# Altium schematic sheet CLK_HMC7044.SchDoc
size A3; DocumentNumber: 1; SheetNumber: 1; SheetTotal: 5
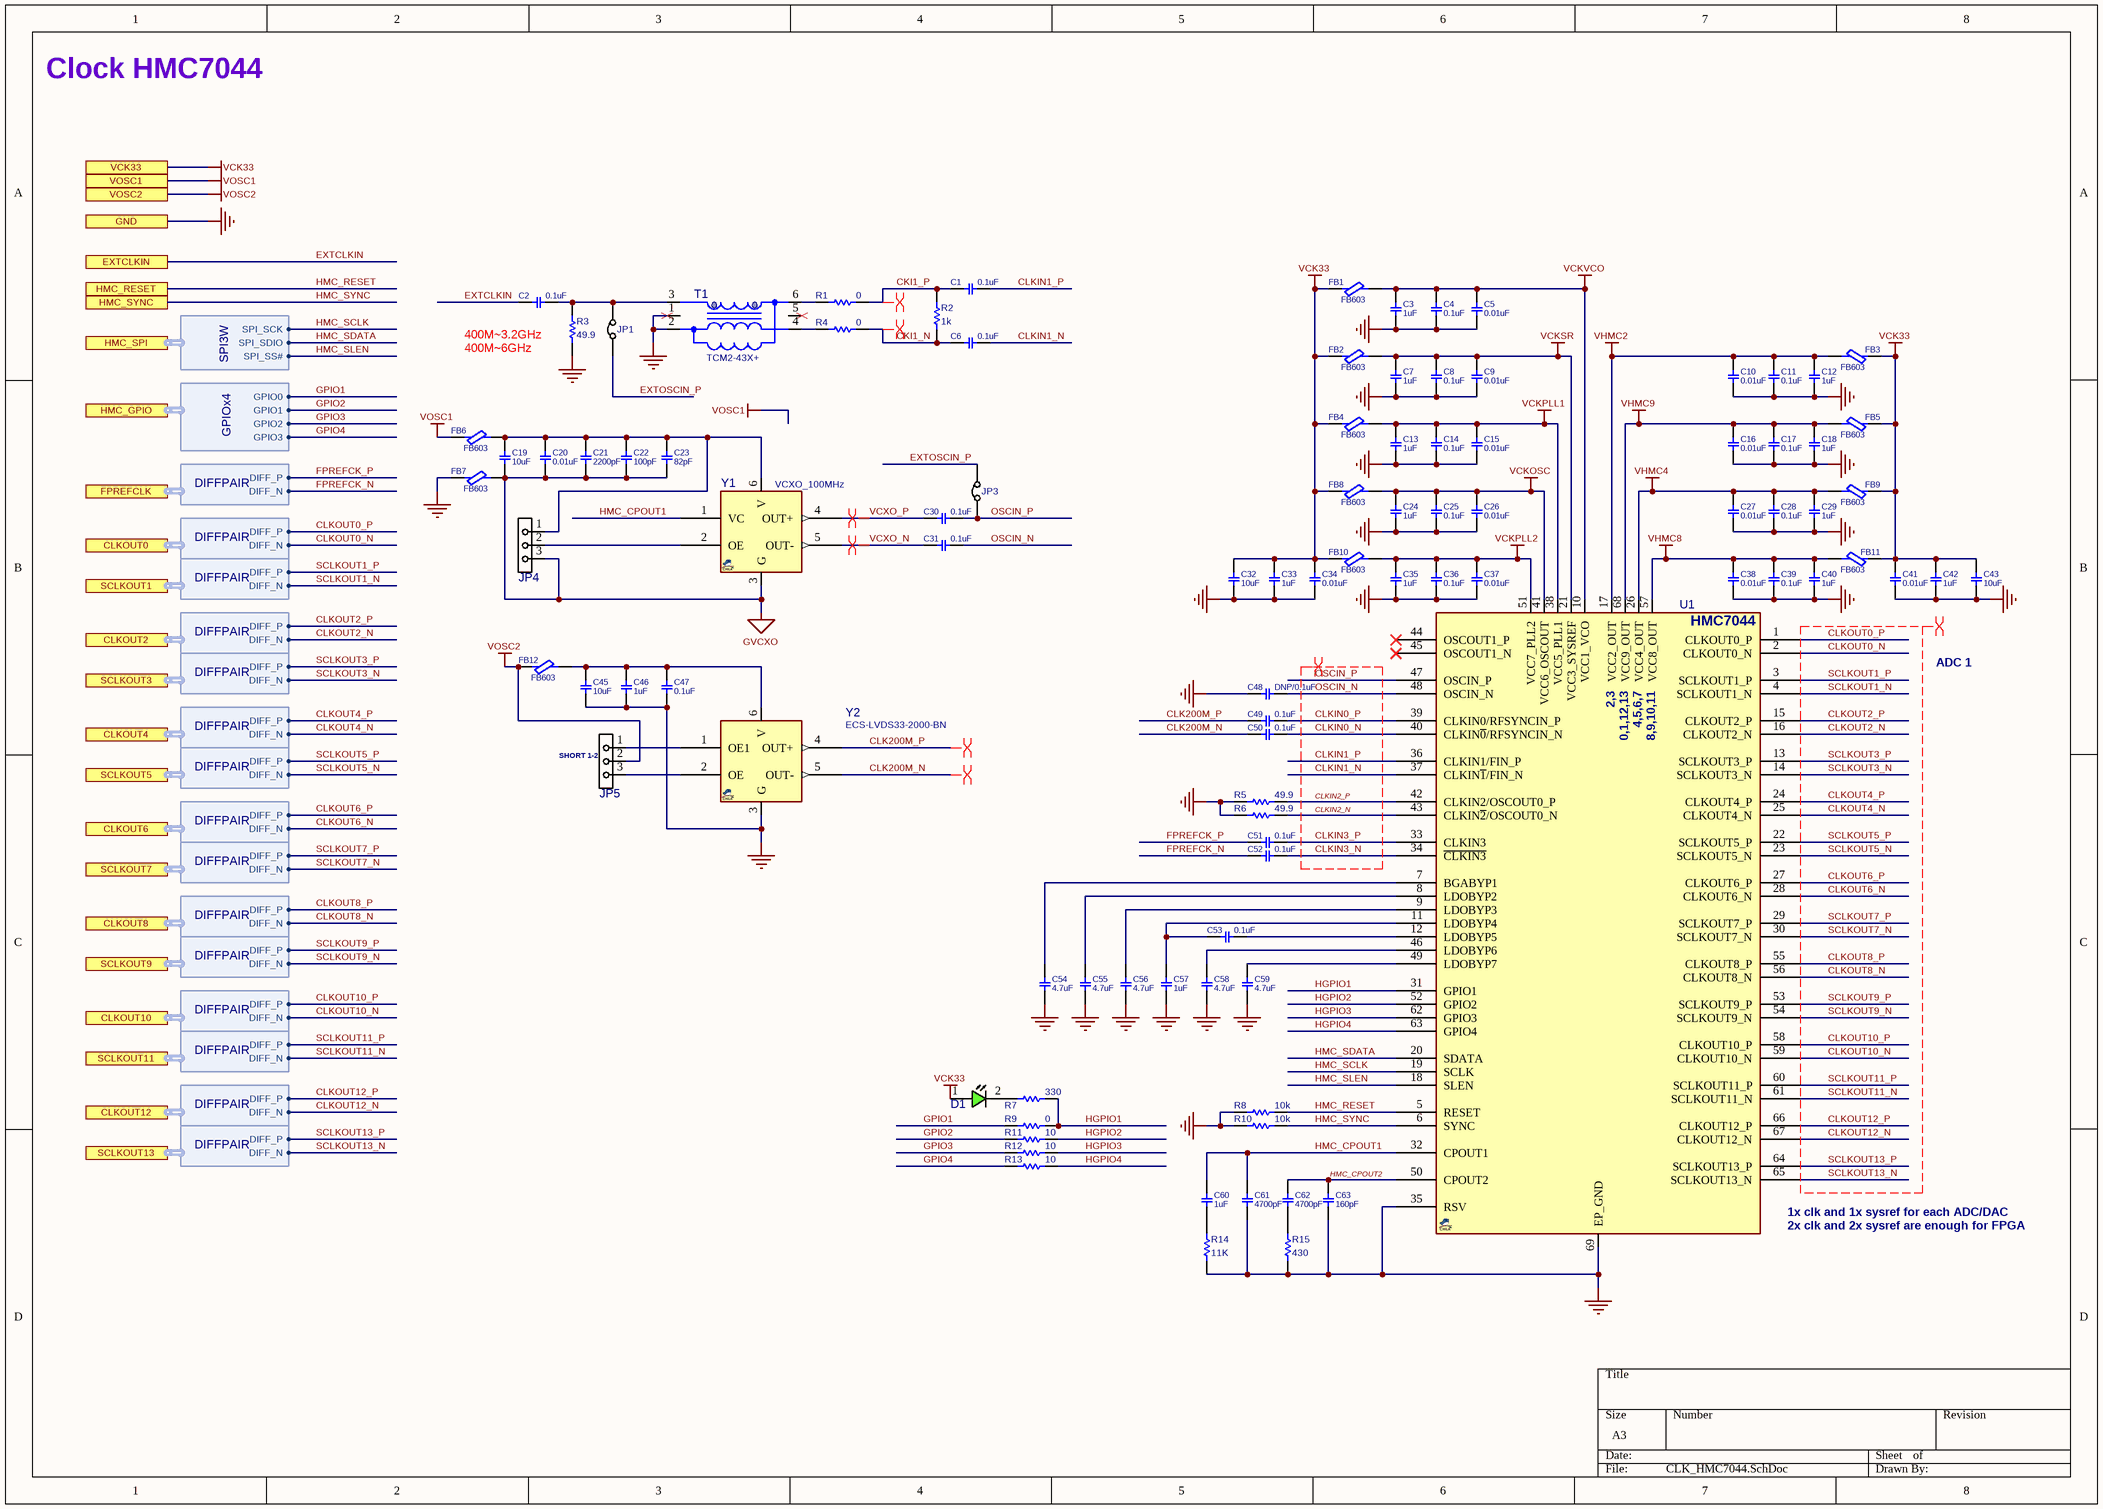
[diagram p0: CLK_HMC7044.SchDoc]

## Parts
C1  0.1uF  [C0402]
C2  0.1uF  [C0402]
C3  1uF  [C0402]
C4  0.1uF  [C0402]
C5  0.01uF  [C0402]
C6  0.1uF  [C0402]
C7  1uF  [C0402]
C8  0.1uF  [C0402]
C9  0.01uF  [C0402]
C10  0.01uF  [C0402]
C11  0.1uF  [C0402]
C12  1uF  [C0402]
C13  1uF  [C0402]
C14  0.1uF  [C0402]
C15  0.01uF  [C0402]
C16  0.01uF  [C0402]
C17  0.1uF  [C0402]
C18  1uF  [C0402]
C19  10uF  [C0402]
C20  0.01uF  [C0402]
C21  2200pF  [C0402]
C22  100pF  [C0402]
C23  82pF  [C0402]
C24  1uF  [C0402]
C25  0.1uF  [C0402]
C26  0.01uF  [C0402]
C27  0.01uF  [C0402]
C28  0.1uF  [C0402]
C29  1uF  [C0402]
C30  0.1uF  [C0402]
C31  0.1uF  [C0402]
C32  10uF  [C0402]
C33  1uF  [C0402]
C34  0.01uF  [C0402]
C35  1uF  [C0402]
C36  0.1uF  [C0402]
C37  0.01uF  [C0402]
C38  0.01uF  [C0402]
C39  0.1uF  [C0402]
C40  1uF  [C0402]
C41  0.01uF  [C0402]
C42  1uF  [C0402]
C43  10uF  [C0402]
C45  10uF  [C0402]
C46  1uF  [C0402]
C47  0.1uF  [C0402]
C48  DNP/0.1uF  [C0402]
C49  0.1uF  [C0402]
C50  0.1uF  [C0402]
C51  0.1uF  [C0402]
C52  0.1uF  [C0402]
C53  0.1uF  [C0402]
C54  4.7uF  [C0402]
C55  4.7uF  [C0402]
C56  4.7uF  [C0402]
C57  1uF  [C0402]
C58  4.7uF  [C0402]
C59  4.7uF  [C0402]
C60  1uF  [C0402]
C61  4700pF  [C0402]
C62  4700pF  [C0402]
C63  160pF  [C0402]
D1  LED603GRN  [LED0603GRN]  (value not drawn)
FB1  FB603  [L0603]
FB2  FB603  [L0603]
FB3  FB603  [L0603]
FB4  FB603  [L0603]
FB5  FB603  [L0603]
FB6  FB603  [L0603]
FB7  FB603  [L0603]
FB8  FB603  [L0603]
FB9  FB603  [L0603]
FB10  FB603  [L0603]
FB11  FB603  [L0603]
FB12  FB603  [L0603]
JP1  JMPSOLDER  [JP_40X50]  (value not drawn)  (no BOM)
JP3  JMPSOLDER  [JP_40X50]  (value not drawn)  (no BOM)
JP4  JMPHDR3PIN  [JP_3_40X90]  (value not drawn)  (no BOM)
JP5  JMPHDR3PIN  [JP_3_40X90]  (value not drawn)  (no BOM)
R1  0  [R0402]
R2  1k  [R0402]
R3  49.9  [R0402]
R4  0  [R0402]
R5  49.9  [R0402]
R6  49.9  [R0402]
R7  330  [R0402]
R8  10k  [R0402]
R9  0  [R0402]
R10  10k  [R0402]
R11  10  [R0402]
R12  10  [R0402]
R13  10  [R0402]
R14  11K  [R0402]
R15  430  [R0402]
T1  TCM2-43X+  [TRNS127_6_S380CW]
U1  HMC7044  [QFN50_68T]  (value not drawn)
Y1  VCXO_100MHz  [XTL_6_9X14]
Y2  ECS-LVDS33-2000-BN  [XTL_6_7050]

## Ports
CLKOUT0 (harness DIFFPAIR), CLKOUT2 (harness DIFFPAIR), CLKOUT4 (harness DIFFPAIR), CLKOUT6 (harness DIFFPAIR), CLKOUT8 (harness DIFFPAIR), CLKOUT10 (harness DIFFPAIR), CLKOUT12 (harness DIFFPAIR), EXTCLKIN, FPREFCLK (harness DIFFPAIR), GND, HMC_GPIO (harness GPIOx4), HMC_RESET, HMC_SPI (harness SPI3W), HMC_SYNC, SCLKOUT1 (harness DIFFPAIR), SCLKOUT3 (harness DIFFPAIR), SCLKOUT5 (harness DIFFPAIR), SCLKOUT7 (harness DIFFPAIR), SCLKOUT9 (harness DIFFPAIR), SCLKOUT11 (harness DIFFPAIR), SCLKOUT13 (harness DIFFPAIR), VCK33, VOSC1, VOSC2

## Harnesses
SPI3W: SPI_SCK, SPI_SDIO, SPI_SS#
GPIOx4: GPIO0, GPIO1, GPIO2, GPIO3
DIFFPAIR: DIFF_N, DIFF_P

## Nets
GND: C3.2 C4.2 C5.2 C7.2 C8.2 C9.2 C10.2 C11.2 C12.2 C13.2 C14.2 C15.2 C16.2 C17.2 C18.2 C24.2 C25.2 C26.2 C27.2 C28.2 C29.2 C32.2 C33.2 C34.2 C35.2 C36.2 C37.2 C38.2 C39.2 C40.2 C41.2 C42.2 C43.2 C45.2 C46.2 C47.1 C48.1 C54.2 C55.2 C56.2 C57.2 C58.2 C59.2 C61.1 C63.1 FB7.1 R3.1 R5.2 R6.2 R8.1 R10.1 R14.1 R15.1 T1.1(NC) T1.2(PRI) U1.35(RSV) U1.69(EP_GND) Y2.3(G) ; port GND
GVCXO: C19.2 C20.1 C21.1 C22.1 C23.1 FB7.2 JP4.3 Y1.3(G)
VCK33: C32.1 C33.1 C34.1 C41.1 C42.1 C43.1 D1.1(ANODE) FB1.1 FB2.1 FB3.1 FB4.1 FB5.1 FB8.1 FB9.1 FB10.1 FB11.1 ; port VCK33
VCKOSC: C24.1 C25.1 C26.1 FB8.2 U1.41(VCC6_OSCOUT)
VCKPLL1: C13.1 C14.1 C15.1 FB4.2 U1.38(VCC5_PLL1)
VCKPLL2: C35.1 C36.1 C37.1 FB10.2 U1.51(VCC7_PLL2)
VCKSR: C7.1 C8.1 C9.1 FB2.2 U1.21(VCC3_SYSREF)
VCKVCO: C3.1 C4.1 C5.1 FB1.2 U1.10(VCC1_VCO)
VHMC2: C10.1 C11.1 C12.1 FB3.2 U1.17(VCC2_OUT)
VHMC4: C27.1 C28.1 C29.1 FB9.2 U1.26(VCC4_OUT)
VHMC8: C38.1 C39.1 C40.1 FB11.2 U1.57(VCC8_OUT)
VHMC9: C16.1 C17.1 C18.1 FB5.2 U1.68(VCC9_OUT)
VOSC1: FB6.1 ; port VOSC1
VOSC2: FB12.1 JP5.2 ; port VOSC2
CKI1_N: C6.1 R2.1 R4.1
CKI1_P: C1.1 R1.1 R2.2
CLK200M_N: C50.1 Y2.5(OUT-)
CLK200M_P: C49.1 Y2.4(OUT+)
CLKIN0_N: C50.2 U1.40(CLKIN~{0}/RFSYNCIN_N)
CLKIN0_P: C49.2 U1.39(CLKIN0/RFSYNCIN_P)
CLKIN1_N: C6.2 U1.37(CLKIN~{1}/FIN_N)
CLKIN1_P: C1.2 U1.36(CLKIN1/FIN_P)
CLKIN2_N: R6.1 U1.43(CLKIN~{2}/OSCOUT0_N)
CLKIN2_P: R5.1 U1.42(CLKIN2/OSCOUT0_P)
CLKIN3_N: C52.2 U1.34(~{CLKIN3})
CLKIN3_P: C51.2 U1.33(CLKIN3)
CLKOUT0_N: U1.2(CLKOUT0_N) ; port CLKOUT0.DIFF_N
CLKOUT0_P: U1.1(CLKOUT0_P) ; port CLKOUT0.DIFF_P
CLKOUT2_N: U1.16(CLKOUT2_N) ; port CLKOUT2.DIFF_N
CLKOUT2_P: U1.15(CLKOUT2_P) ; port CLKOUT2.DIFF_P
CLKOUT4_N: U1.25(CLKOUT4_N) ; port CLKOUT4.DIFF_N
CLKOUT4_P: U1.24(CLKOUT4_P) ; port CLKOUT4.DIFF_P
CLKOUT6_N: U1.28(CLKOUT6_N) ; port CLKOUT6.DIFF_N
CLKOUT6_P: U1.27(CLKOUT6_P) ; port CLKOUT6.DIFF_P
CLKOUT8_N: U1.56(CLKOUT8_N) ; port CLKOUT8.DIFF_N
CLKOUT8_P: U1.55(CLKOUT8_P) ; port CLKOUT8.DIFF_P
CLKOUT10_N: U1.59(CLKOUT10_N) ; port CLKOUT10.DIFF_N
CLKOUT10_P: U1.58(CLKOUT10_P) ; port CLKOUT10.DIFF_P
CLKOUT12_N: U1.67(CLKOUT12_N) ; port CLKOUT12.DIFF_N
CLKOUT12_P: U1.66(CLKOUT12_P) ; port CLKOUT12.DIFF_P
EXTCLKIN: C2.1 ; port EXTCLKIN
EXTOSCIN_P: JP1.1 JP3.2
FPREFCK_N: C52.1 ; port FPREFCLK.DIFF_N
FPREFCK_P: C51.1 ; port FPREFCLK.DIFF_P
GPIO1: R9.2 ; port HMC_GPIO.GPIO0
GPIO2: R11.2 ; port HMC_GPIO.GPIO1
GPIO3: R12.2 ; port HMC_GPIO.GPIO2
GPIO4: R13.2 ; port HMC_GPIO.GPIO3
HGPIO1: R7.2 R9.1 U1.31(GPIO1)
HGPIO2: R11.1 U1.52(GPIO2)
HGPIO3: R12.1 U1.62(GPIO3)
HGPIO4: R13.1 U1.63(GPIO4)
HMC_CPOUT1: C60.1 C61.2 U1.32(CPOUT1) Y1.1(VC)
HMC_CPOUT2: C62.2 C63.2 U1.50(CPOUT2)
HMC_RESET: R8.2 U1.5(RESET) ; port HMC_RESET
HMC_SCLK: U1.19(SCLK) ; port HMC_SPI.SPI_SCK
HMC_SDATA: U1.20(SDATA) ; port HMC_SPI.SPI_SDIO
HMC_SLEN: U1.18(SLEN) ; port HMC_SPI.SPI_SS#
HMC_SYNC: R10.2 U1.6(SYNC) ; port HMC_SYNC
OSCIN_N: C31.2 C48.2 U1.48(OSCIN_N)
OSCIN_P: C30.2 JP3.1 U1.47(OSCIN_P)
SCLKOUT1_N: U1.4(SCLKOUT1_N) ; port SCLKOUT1.DIFF_N
SCLKOUT1_P: U1.3(SCLKOUT1_P) ; port SCLKOUT1.DIFF_P
SCLKOUT3_N: U1.14(SCLKOUT3_N) ; port SCLKOUT3.DIFF_N
SCLKOUT3_P: U1.13(SCLKOUT3_P) ; port SCLKOUT3.DIFF_P
SCLKOUT5_N: U1.23(SCLKOUT5_N) ; port SCLKOUT5.DIFF_N
SCLKOUT5_P: U1.22(SCLKOUT5_P) ; port SCLKOUT5.DIFF_P
SCLKOUT7_N: U1.30(SCLKOUT7_N) ; port SCLKOUT7.DIFF_N
SCLKOUT7_P: U1.29(SCLKOUT7_P) ; port SCLKOUT7.DIFF_P
SCLKOUT9_N: U1.54(SCLKOUT9_N) ; port SCLKOUT9.DIFF_N
SCLKOUT9_P: U1.53(SCLKOUT9_P) ; port SCLKOUT9.DIFF_P
SCLKOUT11_N: U1.61(SCLKOUT11_N) ; port SCLKOUT11.DIFF_N
SCLKOUT11_P: U1.60(SCLKOUT11_P) ; port SCLKOUT11.DIFF_P
SCLKOUT13_N: U1.65(SCLKOUT13_N) ; port SCLKOUT13.DIFF_N
SCLKOUT13_P: U1.64(SCLKOUT13_P) ; port SCLKOUT13.DIFF_P
VCXO_N: C31.1 Y1.5(OUT-)
VCXO_P: C30.1 Y1.4(OUT+)
NetC2_2: C2.2 JP1.2 R3.2 T1.3(PRI.)
NetC19_1: C19.1 C20.2 C21.2 C22.2 C23.2 FB6.2 JP4.1 Y1.6(V)
NetC45_1: C45.1 C46.1 C47.2 FB12.2 Y2.6(V)
NetC53_1: C53.1 C57.1 U1.11(LDOBYP4)
NetC53_2: C53.2 U1.12(LDOBYP5)
NetC54_1: C54.1 U1.7(BGABYP1)
NetC55_1: C55.1 U1.8(LDOBYP2)
NetC56_1: C56.1 U1.9(LDOBYP3)
NetC58_1: C58.1 U1.46(LDOBYP6)
NetC59_1: C59.1 U1.49(LDOBYP7)
NetC60_2: C60.2 R14.2
NetC62_1: C62.1 R15.2
NetD1_2: D1.2(CATHODE) R7.1
NetJP4_2: JP4.2 Y1.2(OE)
NetJP5_1: JP5.1 Y2.1(OE1)
NetJP5_3: JP5.3 Y2.2(OE)
NetR1_2: R1.2 T1.6(SEC.)
NetR4_2: R4.2 T1.4(SEC)

Not connected (* = marked no-connect by the designer): T1 5(NC); U1 44(OSCOUT1_P)* 45(OSCOUT1_N)*

## Layout directives
differential pair: CKI1_N, CKI1_P, CLK200M_N, CLK200M_P, CLKIN0_N, CLKIN0_P, CLKIN1_N, CLKIN1_P, CLKIN2_N, CLKIN2_P, CLKIN3_N, CLKIN3_P, CLKOUT0_N, CLKOUT0_P, CLKOUT2_N, CLKOUT2_P, CLKOUT4_N, CLKOUT4_P, CLKOUT6_N, CLKOUT6_P, CLKOUT8_N, CLKOUT8_P, CLKOUT10_N, CLKOUT10_P, CLKOUT12_N, CLKOUT12_P, OSCIN_N, OSCIN_P, SCLKOUT1_N, SCLKOUT1_P, SCLKOUT3_N, SCLKOUT3_P, SCLKOUT5_N, SCLKOUT5_P, SCLKOUT7_N, SCLKOUT7_P, SCLKOUT9_N, SCLKOUT9_P, SCLKOUT11_N, SCLKOUT11_P, SCLKOUT13_N, SCLKOUT13_P, VCXO_N, VCXO_P

## Notes on the sheet
- Clock HMC7044
- 400M~3.2GHz
- 400M~6GHz
- ADC 1
- (near JP5) SHORT 1-2
- (near U1) 2x clk and 2x sysref are enough for FPGA
- (near U1) 1x clk and 1x sysref for each ADC/DAC
- (in symbol HMC7044_QFN68) 2,3; 0,1,12,13; 4,5,6,7; 8,9,10,11

## Library data of the parts
C1 C2 C4-C6 C8-C11 C14-C17 C20 C21 C25-C28 C30 C31 C34 C36-C39 C41 C47-C53 C61 C62 = CAP_SMD_MLCC_100n50T: CAP, MLCC; PARAM: 50V; PARAM2: X5R, 10%; MANF_P#: -; MANF: -; DESC: -; ASSEMBLY: ASSEMBLY
  C1 C2 C4 C6 C8 C11 C14 C17 C25 C28 C30 C31 C36 C39 C47 C49-C53: PRICE: 100= 5$; VALUE: 0.1uF
  C5 C9 C10 C15 C16 C26 C27 C34 C37 C38 C41: PRICE: 100= 5$; VALUE: 0.01uF
  C20: PRICE: -; VALUE: 0.01uF
  C21: PRICE: -; VALUE: 2200pF
  C48: PRICE: 100= 5$; VALUE: DNP/0.1uF
  C61 C62: PRICE: -; VALUE: 4700pF
C3 C7 C12 C13 C18 C19 C24 C29 C32 C33 C35 C40 C42 C43 C45 C46 C54-C60 = CAP_SMD_MLCC_100n50T: CAP, MLCC; PARAM: 10V; PARAM2: X5R, 10%; MANF_P#: -; MANF: -; DESC: -; ASSEMBLY: ASSEMBLY; PRICE: 100= 5$
  C3 C7 C12 C13 C18 C24 C29 C33 C35 C40 C42 C46 C57 C60: VALUE: 1uF
  C19 C32 C43 C45: VALUE: 10uF
  C54-C56 C58 C59: VALUE: 4.7uF
C22 C23 C63 = CAP_SMD_MLCC_100n50T: CAP, MLCC; PARAM: 50V; PARAM2: C0G, 10%; MANF_P#: -; MANF: -; DESC: -; ASSEMBLY: ASSEMBLY; PRICE: -
  C22: VALUE: 100pF
  C23: VALUE: 82pF
  C63: VALUE: 160pF
D1 = LED_SMD_0603_GRN: LED, SMD, 0603, GREEN; PARAM: 20mA; MANF: Kingbright; DESC: DESCRIPTION; MANF_P#: APT1608SGC; PARAM2: 2.2V; ASSEMBLY: ASSEMBLY; PRICE: 1: 0.14$, 100: 6.8$; VALUE: LED603GRN
FB1-FB12 = FBEAD_SMD_BLM18PG121: FERRITE_Bead, 0603, 2A, 50mOhm, 120@100MHz; MANF: MURATA; MANF_P#: BLM18PG121SN1D; PARAM: 120@100MHz; PARAM2: 2A, 50mOhm; VALUE: FB603
JP1 JP3 = JUMPER_SOLDER: JUMPER,  solder; MANF: MANF; MANF_P#: MANF_P#; VALUE: JMPSOLDER
JP4 JP5 = JUMPER_SOLDER_3P: JUMPER, HEADER 3PIN; MANF: MANF; MANF_P#: MANF_P#; VALUE: JMPHDR3PIN
R1-R8 R10 R14 R15 = Res: Resistor
  R1 R4: Value: 0
  R2: Value: 1k
  R3 R5 R6: Value: 49.9
  R7: Value: 330
  R8 R10: Value: 10k
  R14: Value: 11K
  R15: Value: 430
R9 R11-R13 = RES_SMD_0402: RESISTOR, SMD; PARAM: -W; DESC: DESCRIPTION; DIST#: MOUSER; PARAM2: 1%; MANF_P#: -; MANF: -; ASSEMBLY: ASSEMBLY; PRICE: 100= 0.5$
  R9: VALUE: 0
  R11-R13: VALUE: 10
T1 = TCM2-43X+: RF Transformer, 1:2, 50Ohm, 10~4000MHz; MANF: Mini-Circuit; PARAM: 10~6000MHz; DESC: DESCRIPTION; PARAM2: 0.4W, 30mA, -40~85°C; ASSEMBLY: ASSEMBLY; PRICE: PRICE; MANF_P#: TCM2-43X+; VALUE: TCM2-43X+
U1 = HMC7044_QFN68: Clock Synthesizer / Jitter Cleaner HiPerf,3.2 GHz,14-OP Jttr Att w/JESD204B; MANF: Analog Devices; MANF_P#: HMC7044LP10BE; PARAM: -; PRICE: -; VALUE: HMC7044
Y1 = OSC_6_CVPD-920-100M: CLOCK OSCILLATOR,; MANF: CRYSTEK; MANF_P#: CVPD-920X-100; PARAM2: 3.3V; PARAM: 20 PPM; VALUE: VCXO_100MHz
Y2 = OSC_6_SIT9102_200MHz: CLOCK OSCILLATOR, DIFFERENTIAL, 200MHZ; MANF: SiTime; DESC: DESCRIPTION; MANF_P#: SIT9102AI-243N25E200.0000; PARAM2: 50PPM; ASSEMBLY: ASSEMBLY; PARAM: PARAM; PRICE: PRICE; VALUE: ECS-LVDS33-2000-BN